# EAGLE schematic valve_indicator (EAGLE 9.6.2)

## Sheet 1 of 2: Processor
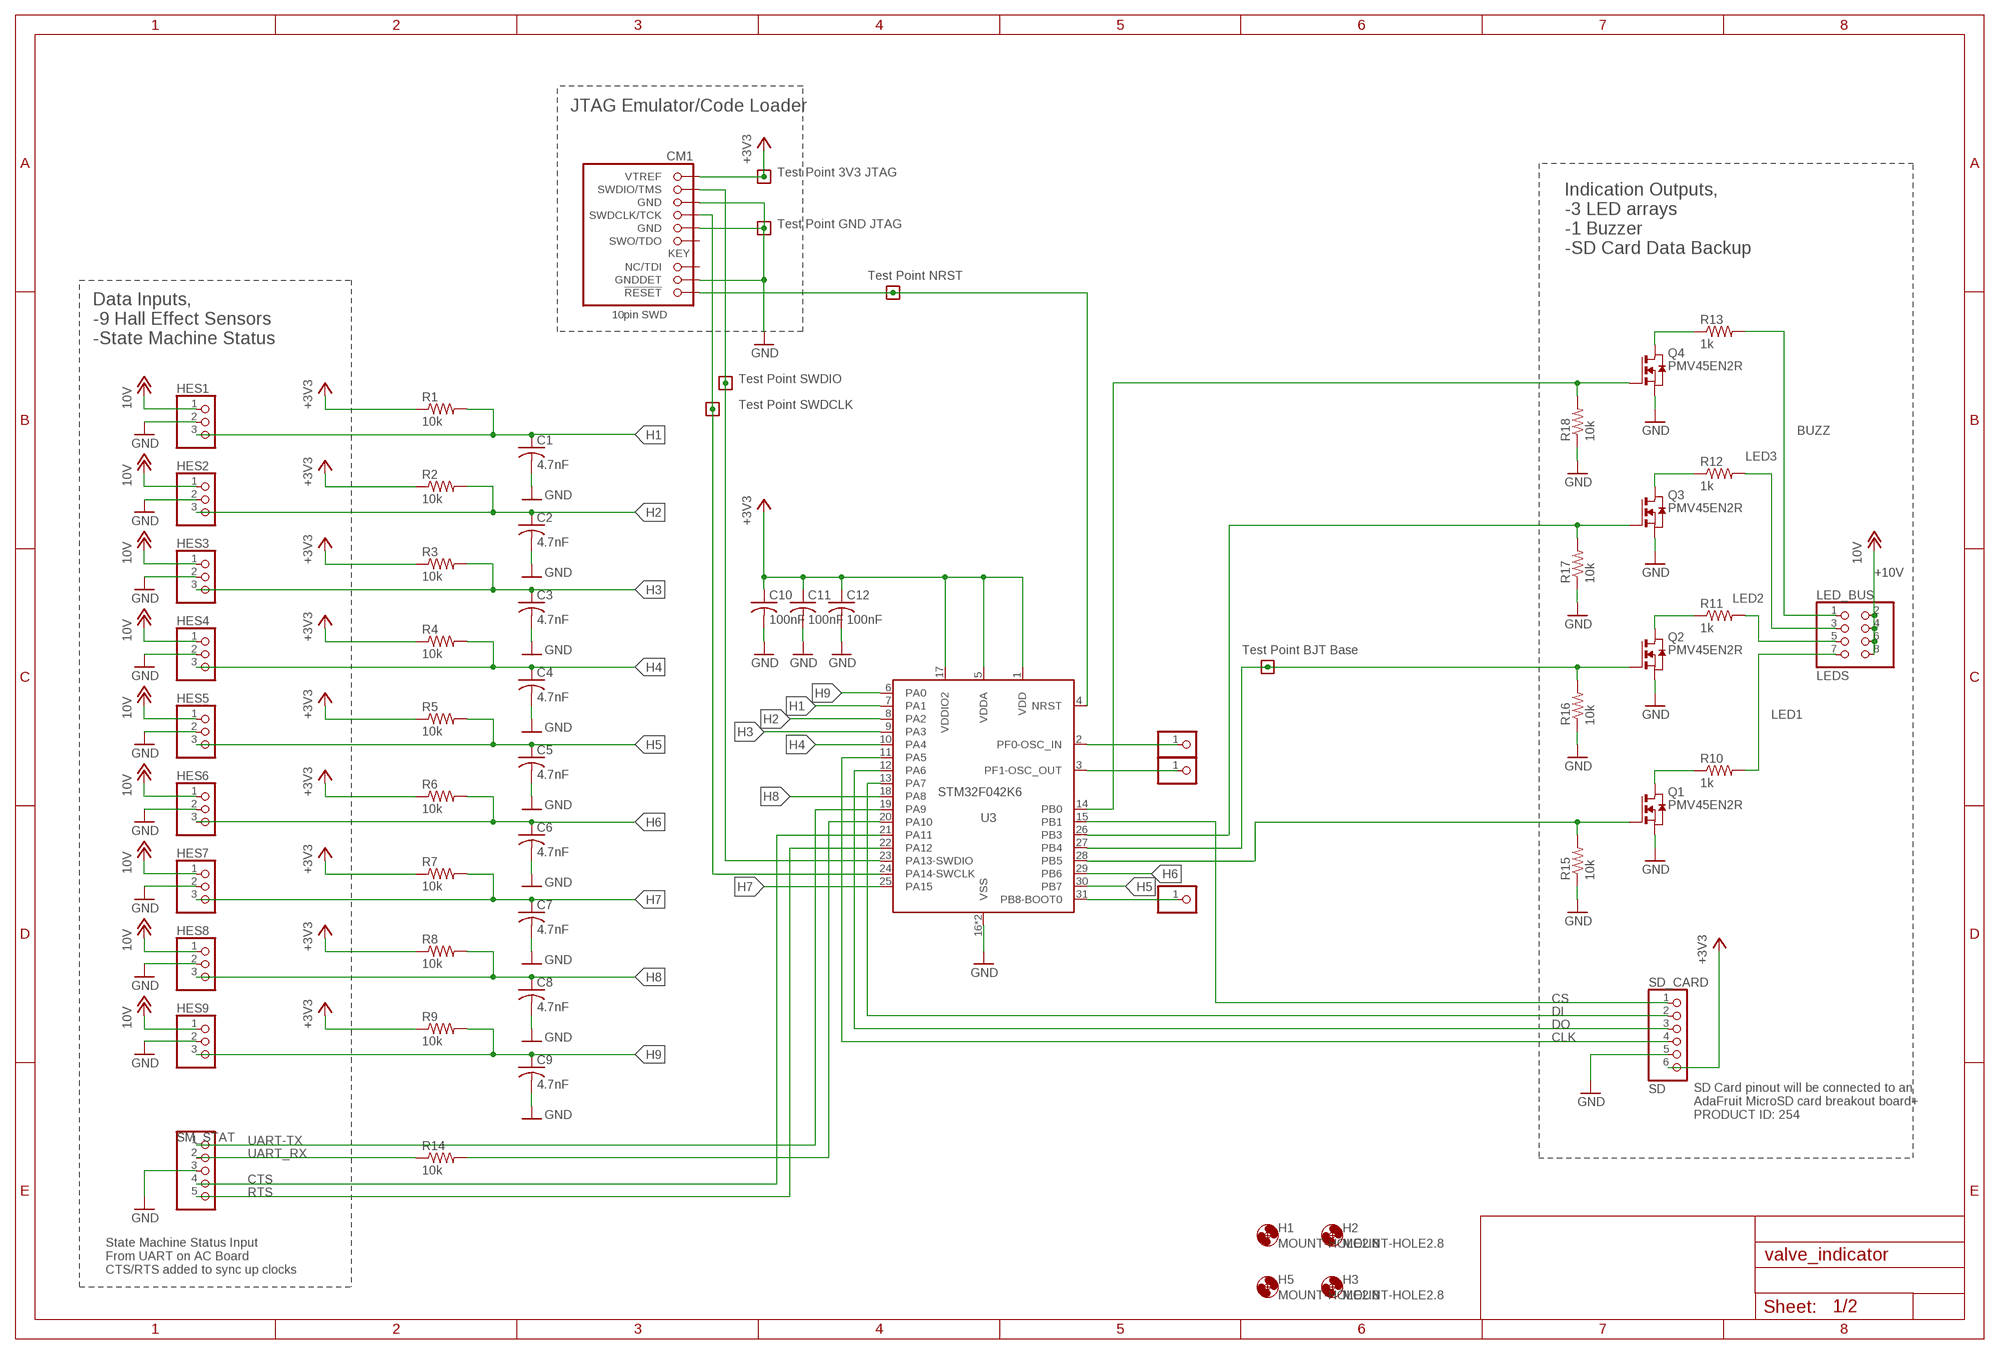
[diagram p0: schematic, sheet 1]

### Parts
C1  4.7nF  C-USC0603  [C0603]
C2  4.7nF  C-USC0603  [C0603]
C3  4.7nF  C-USC0603  [C0603]
C4  4.7nF  C-USC0603  [C0603]
C5  4.7nF  C-USC0603  [C0603]
C6  4.7nF  C-USC0603  [C0603]
C7  4.7nF  C-USC0603  [C0603]
C8  4.7nF  C-USC0603  [C0603]
C9  4.7nF  C-USC0603  [C0603]
C10  100nF  C-USC0603  [C0603]
C11  100nF  C-USC0603  [C0603]
C12  100nF  C-USC0603  [C0603]
CM1  FTSH-105-XX-X-DV-K  [CON10_2X5_DUK_FTSH]
H1  MOUNT-HOLE2.8  [2,8]
H2  MOUNT-HOLE2.8  [2,8]
H3  MOUNT-HOLE2.8  [2,8]
H5  MOUNT-HOLE2.8  [2,8]
HES1  HES1  PINHD-1X3  [1X03]
HES2  HES2  PINHD-1X3  [1X03]
HES3  HES3  PINHD-1X3  [1X03]
HES4  HES4  PINHD-1X3  [1X03]
HES5  HES5  PINHD-1X3  [1X03]
HES6  HES6  PINHD-1X3  [1X03]
HES7  HES7  PINHD-1X3  [1X03]
HES8  HES8  PINHD-1X3  [1X03]
HES9  HES9  PINHD-1X3  [1X03]
JP2  PF0-OSC_IN_PIN  PINHD-1X1  [1X01]
JP3  PF1-OSC_OUT_PIN  PINHD-1X1  [1X01]
JP4  PB8-BOOT0_PIN  PINHD-1X1  [1X01]
LED_BUS  LEDS  PINHD-2X4  [2X04]
Q1  PMV45EN2R  [SOT23]
Q2  PMV45EN2R  [SOT23]
Q3  PMV45EN2R  [SOT23]
Q4  PMV45EN2R  [SOT23]
R1  10k  R-US_R0603  [R0603]
R2  10k  R-US_R0603  [R0603]
R3  10k  R-US_R0603  [R0603]
R4  10k  R-US_R0603  [R0603]
R5  10k  R-US_R0603  [R0603]
R6  10k  R-US_R0603  [R0603]
R7  10k  R-US_R0603  [R0603]
R8  10k  R-US_R0603  [R0603]
R9  10k  R-US_R0603  [R0603]
R10  1k  R-US_R0603  [R0603]
R11  1k  R-US_R0603  [R0603]
R12  1k  R-US_R0603  [R0603]
R13  1k  R-US_R0603  [R0603]
R14  10k  R-US_R0603  [R0603]
R15  10k  R-US_R0603  [R0603]
R16  10k  R-US_R0603  [R0603]
R17  10k  R-US_R0603  [R0603]
R18  10k  R-US_R0603  [R0603]
SD_CARD  SD  PINHD-1X6  [1X06]
SM_STAT  SM_STAT  PINHD-1X5  [1X05]
TP3V3J  TEST-POINT-LARGE-SQUARE  [1X01]
TPBASE  TEST-POINT-LARGE-SQUARE  [1X01]
TPJGND  TEST-POINT-LARGE-SQUARE  [1X01]
TPNRST  TEST-POINT-LARGE-SQUARE  [1X01]
TPSCLK  TEST-POINT-LARGE-SQUARE  [1X01]
TPSIO  TEST-POINT-LARGE-SQUARE  [1X01]
U3  STM32F042K6  [QFP32-7X7]

### Nets
+3V3: C10.1 C11.1 C12.1 CM1.1(VTREF) R1.1 R2.1 R3.1 R4.1 R5.1 R6.1 R7.1 R8.1 R9.1 SD_CARD.6 TP3V3J.1 U3.1(VDD) U3.5(VDDA) U3.17(VDDIO2) ; also sheet 2
+10V: HES1.1 HES2.1 HES3.1 HES4.1 HES5.1 HES6.1 HES7.1 HES8.1 HES9.1 LED_BUS.2 LED_BUS.4 LED_BUS.6 LED_BUS.8 ; supply symbol labelled 10V ; also sheet 2
BUZZ: LED_BUS.1 R13.2
CLK: SD_CARD.4 U3.11(PA5)
CS: SD_CARD.1 U3.15(PB1)
CTS: SM_STAT.4 U3.21(PA11)
DI: SD_CARD.2 U3.13(PA7)
DO: SD_CARD.3 U3.12(PA6)
GND: C1.2 C2.2 C3.2 C4.2 C5.2 C6.2 C7.2 C8.2 C9.2 C10.2 C11.2 C12.2 CM1.3(GND) CM1.5(GND) CM1.9(GNDDET) HES1.2 HES2.2 HES3.2 HES4.2 HES5.2 HES6.2 HES7.2 HES8.2 HES9.2 Q1.2(S) Q2.2(S) Q3.2(S) Q4.2(S) R15.1 R16.1 R17.1 R18.1 SD_CARD.5 SM_STAT.3 TPJGND.1 U3.16(VSS) U3.32(VSS) ; also sheet 2
H1: C1.1 HES1.3 R1.2 U3.7(PA1)
H2: C2.1 HES2.3 R2.2 U3.8(PA2)
H3: C3.1 HES3.3 R3.2 U3.9(PA3)
H4: C4.1 HES4.3 R4.2 U3.10(PA4)
H5: C5.1 HES5.3 R5.2 U3.30(PB7)
H6: C6.1 HES6.3 R6.2 U3.29(PB6)
H7: C7.1 HES7.3 R7.2 U3.25(PA15)
H8: C8.1 HES8.3 R8.2 U3.18(PA8)
H9: C9.1 HES9.3 R9.2 U3.6(PA0)
LED1: LED_BUS.7 R10.2
LED2: LED_BUS.5 R11.2
LED3: LED_BUS.3 R12.2
N$1: Q4.3(D) R13.1
N$6: JP2.1 U3.2(PF0-OSC_IN)
N$7: JP3.1 U3.3(PF1-OSC_OUT)
N$8: JP4.1 U3.31(PB8-BOOT0)
N$9: CM1.4(SWDCLK/TCK) TPSCLK.1 U3.24(PA14-SWCLK)
N$13: Q3.3(D) R12.1
N$22: Q1.1(G) R15.2 U3.28(PB5)
N$24: Q3.1(G) R17.2 U3.26(PB3)
N$26: Q1.3(D) R10.1
N$27: Q2.3(D) R11.1
N$30: CM1.2(SWDIO/TMS) TPSIO.1 U3.23(PA13-SWDIO)
N$32: CM1.10(!RESET) TPNRST.1 U3.4(NRST)
N$34: Q4.1(G) R18.2 U3.14(PB0)
N$35: Q2.1(G) R16.2 TPBASE.1 U3.27(PB4)
RTS: SM_STAT.5 U3.22(PA12)
UART-RX: R14.2 U3.20(PA10)
UART-TX: SM_STAT.1 U3.19(PA9)
UART_RX: R14.1 SM_STAT.2
Unconnected: CM1.6(SWO/TDO) CM1.8(NC/TDI)

### Notes on the sheet
- JTAG Emulator/Code Loader
- Test Point 3V3 JTAG
- Test Point GND JTAG
- Indication Outputs,
  -3 LED arrays
  -1 Buzzer
  -SD Card Data Backup
- Test Point NRST
- Data Inputs, 
  -9 Hall Effect Sensors
  -State Machine Status
- Test Point SWDIO
- Test Point SWDCLK
- Test Point BJT Base
- SD Card pinout will be connected to an 
  AdaFruit MicroSD card breakout board+
  PRODUCT ID: 254
- State Machine Status Input
  From UART on AC Board
  CTS/RTS added to sync up clocks

## Sheet 2 of 2: Power Regulators
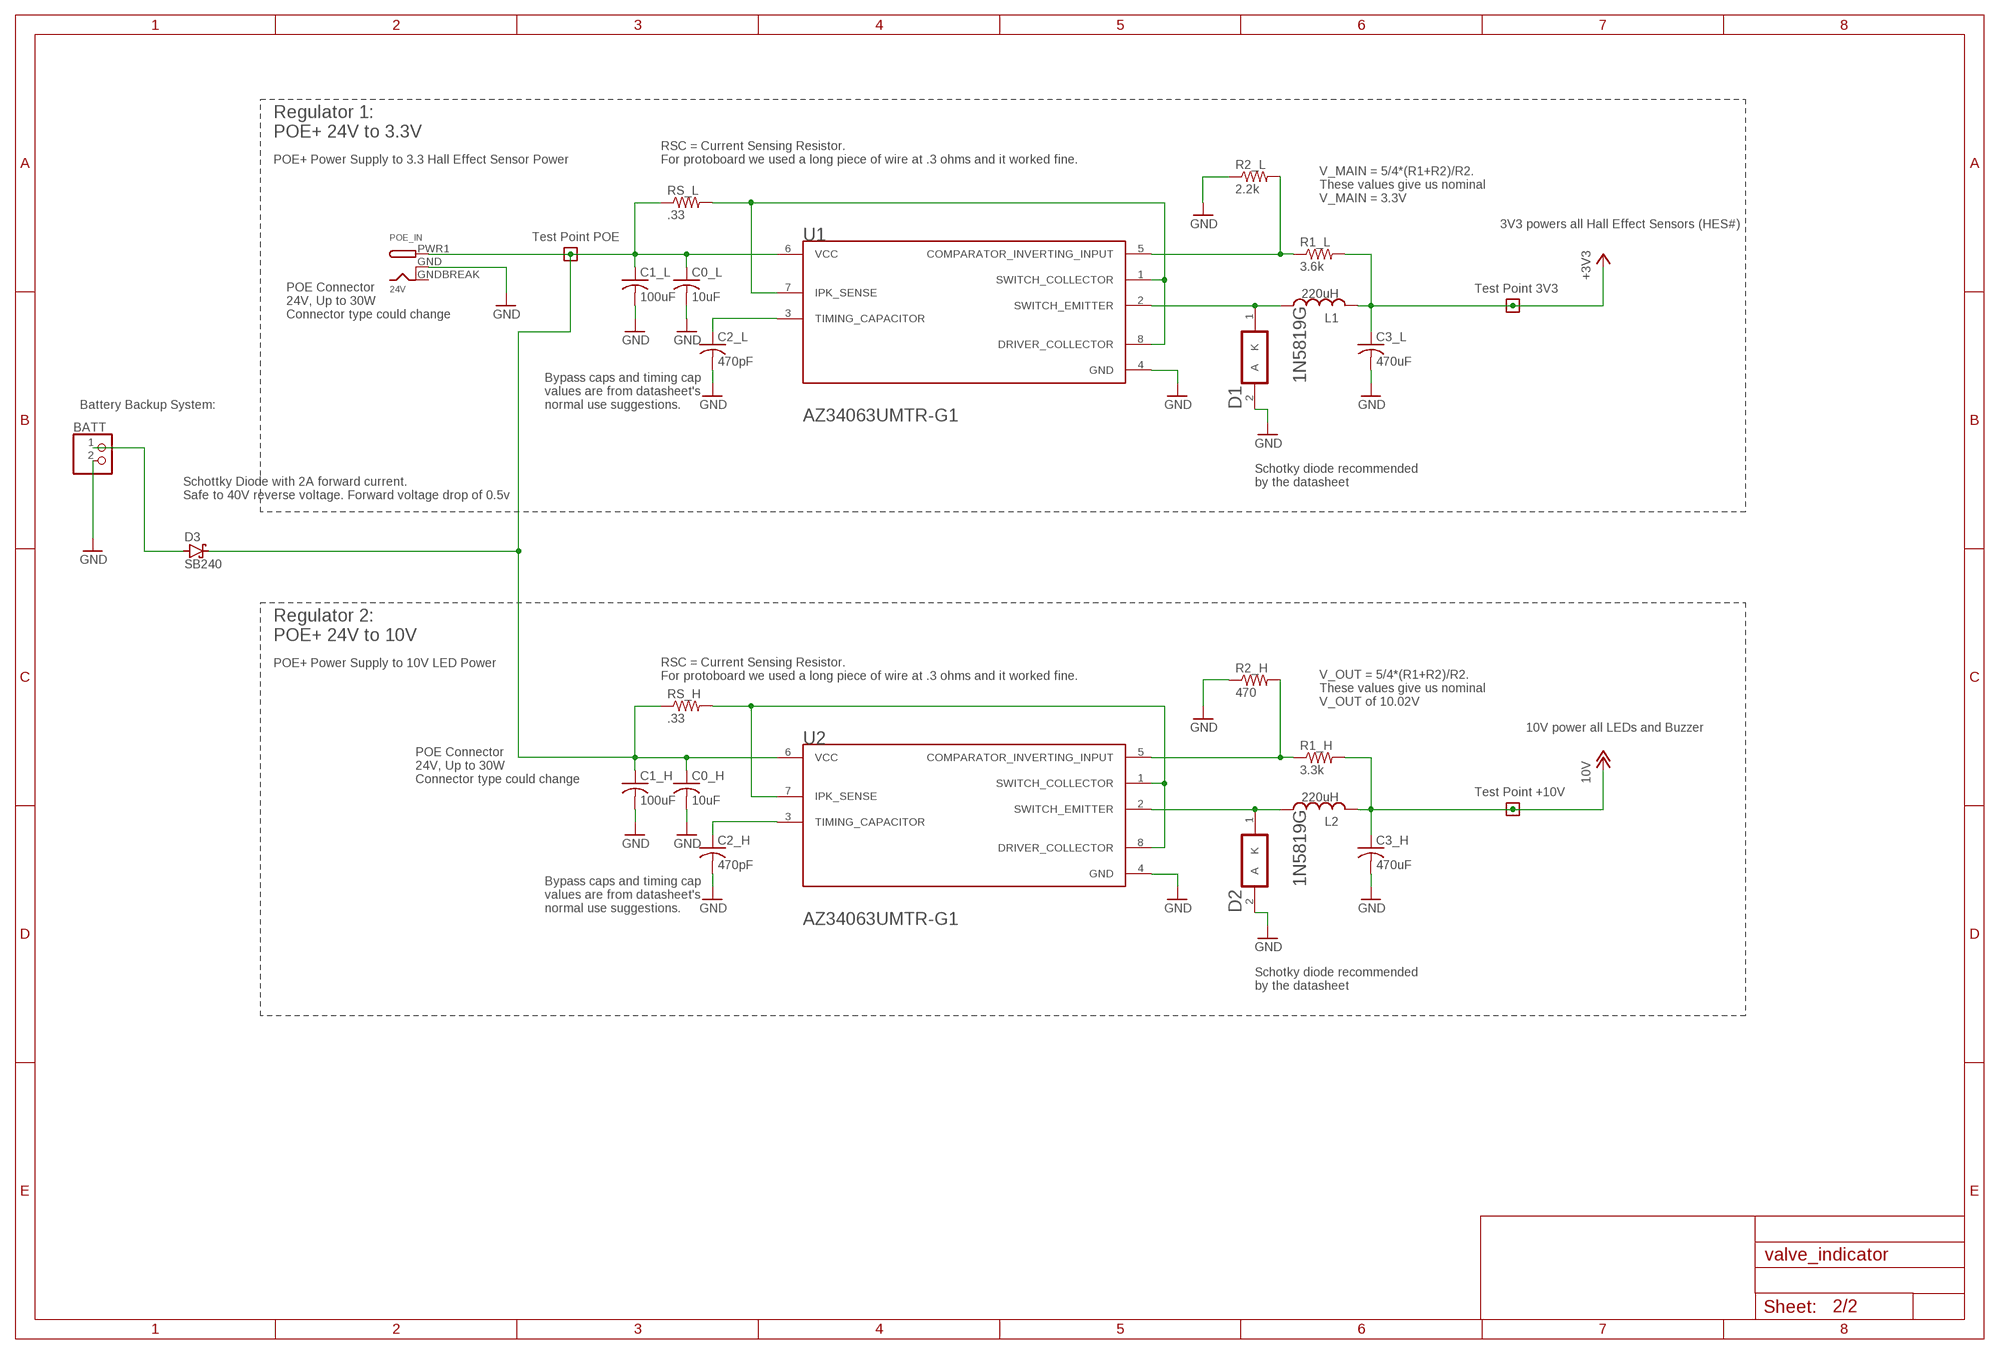
[diagram p1: schematic, sheet 2]

### Parts
BATT  LED1  PINHD-1X2  [1X02]
C0_H  10uF  C-USC1206  [C1206]
C0_L  10uF  C-USC1206  [C1206]
C1_H  100uF  C-US025-025X050  [C025-025X050]
C1_L  100uF  C-US025-025X050  [C025-025X050]
C2_H  470pF  C-USC0603  [C0603]
C2_L  470pF  C-USC0603  [C0603]
C3_H  470uF  C-US025-025X050  [C025-025X050]
C3_L  470uF  C-US025-025X050  [C025-025X050]
D1  1N5819G_0_0  ON_SEMICONDUCTOR_1N5819GON_SEMICONDUCTOR_1N5819G_0_0  [ON_SEMICONDUCTOR_1N5819G_0]
D2  1N5819G_0_0  ON_SEMICONDUCTOR_1N5819GON_SEMICONDUCTOR_1N5819G_0_0  [ON_SEMICONDUCTOR_1N5819G_0]
D3  SB240  1N5817-B  [DO41-7.6]
L1  220uH  L-US0204/5  [0204/5]
L2  220uH  L-US0204/5  [0204/5]
POE_IN  24V  DCBARRELSMT  [DCJACK_2MM_SMT]
R1_H  3.3k  R-US_R0603  [R0603]
R1_L  3.6k  R-US_R0603  [R0603]
R2_H  470  R-US_R0603  [R0603]
R2_L  2.2k  R-US_R0603  [R0603]
RS_H  .33  R-US_R0603  [R0603]
RS_L  .33  R-US_R0603  [R0603]
TP3V3  TEST-POINT-LARGE-SQUARE  [1X01]
TP10V  TEST-POINT-LARGE-SQUARE  [1X01]
TPOE  TEST-POINT-LARGE-SQUARE  [1X01]
U1  AZ34063UMTR-G1  DIODES_INC._AZ34063UMTR-G1DIODES_INC._AZ34063UMTR-G1_0_0  [DIODES_INC._AZ34063UMTR-G1_0]
U2  AZ34063UMTR-G1  DIODES_INC._AZ34063UMTR-G1DIODES_INC._AZ34063UMTR-G1_0_0  [DIODES_INC._AZ34063UMTR-G1_0]

### Nets
+3V3: C3_L.1 L1.2 R1_L.2 TP3V3.1 ; also sheet 1
+10V: C3_H.1 L2.2 R1_H.2 TP10V.1 ; supply symbol labelled 10V ; also sheet 1
GND: BATT.2 C0_H.2 C0_L.2 C1_H.2 C1_L.2 C2_H.2 C2_L.2 C3_H.2 C3_L.2 D1.2(A) D2.2(A) POE_IN.GND(GNDBREAK) R2_H.1 R2_L.1 U1.4(GND) U2.4(GND) ; also sheet 1
N$2: RS_L.2 U1.1(SWITCH_COLLECTOR) U1.7(IPK_SENSE) U1.8(DRIVER_COLLECTOR)
N$3: C2_L.1 U1.3(TIMING_CAPACITOR)
N$4: R1_L.1 R2_L.2 U1.5(COMPARATOR_INVERTING_INPUT)
N$5: D1.1(K) L1.1 U1.2(SWITCH_EMITTER)
N$10: D2.1(K) L2.1 U2.2(SWITCH_EMITTER)
N$16: BATT.1 D3.A
N$18: RS_H.2 U2.1(SWITCH_COLLECTOR) U2.7(IPK_SENSE) U2.8(DRIVER_COLLECTOR)
N$19: C2_H.1 U2.3(TIMING_CAPACITOR)
N$20: R1_H.1 R2_H.2 U2.5(COMPARATOR_INVERTING_INPUT)
POE: C0_H.1 C0_L.1 C1_H.1 C1_L.1 D3.C POE_IN.PWR1(PWR) RS_H.1 RS_L.1 TPOE.1 U1.6(VCC) U2.6(VCC)

### Notes on the sheet
- Regulator 1:
  POE+ 24V to 3.3V
- POE+ Power Supply to 3.3 Hall Effect Sensor Power
- RSC = Current Sensing Resistor.
  For protoboard we used a long piece of wire at .3 ohms and it worked fine.
- V_MAIN = 5/4*(R1+R2)/R2.
  These values give us nominal
  V_MAIN = 3.3V
- 3V3 powers all Hall Effect Sensors (HES#)
- Test Point POE
- Test Point 3V3
- POE Connector 
  24V, Up to 30W 
  Connector type could change
- Battery Backup System:
- Bypass caps and timing cap
  values are from datasheet's
  normal use suggestions.
- Schotky diode recommended
  by the datasheet
- Schottky Diode with 2A forward current. 
  Safe to 40V reverse voltage. Forward voltage drop of 0.5v
- Regulator 2:
  POE+ 24V to 10V
- POE+ Power Supply to 10V LED Power
- RSC = Current Sensing Resistor.
  For protoboard we used a long piece of wire at .3 ohms and it worked fine.
- V_OUT = 5/4*(R1+R2)/R2.
  These values give us nominal
  V_OUT of 10.02V
- 10V power all LEDs and Buzzer
- POE Connector 
  24V, Up to 30W 
  Connector type could change
- Test Point +10V
- Bypass caps and timing cap
  values are from datasheet's
  normal use suggestions.
- Schotky diode recommended
  by the datasheet

## Power pins joined to a net without a drawn wire
GND: POE_IN.GNDBREAK(GND)

## Library data of the parts
BATT = pinhead:PINHD-1X2: PIN HEADER; DIS: Digi-Key; DPN: 900-0022232021-ND; MFR: Molex; MPN: 0022232021
C0_H C0_L = rcl:C-US: CAPACITOR, American symbol; DIS: Digi-Key; DPN: 1276-6736-1-ND; MFR: Samsung Electro-Mechanics; MPN: CL31A106MBHNNNE; SPICEPREFIX: C
C1-C9 = rcl:C-US: CAPACITOR, American symbol; DIS: Digi-Key; DPN: 445-7400-1-ND; MFR: TDK Corporation; MPN: C1608C0G1H472J080AA; SPICEPREFIX: C
C1_H C1_L = rcl:C-US: CAPACITOR, American symbol; DIS: Digi-Key; DPN: 1572-1044-ND; MFR: Illinois Capacitor; MPN: 107CKR050M; SPICEPREFIX: C
C2_H C2_L = rcl:C-US: CAPACITOR, American symbol; DIS: Digi-Key; DPN: 1292-1438-1-ND; MFR: Walsin Technology Corporation; MPN: 0603B471K500CT; SPICEPREFIX: C
C3_H C3_L = rcl:C-US: CAPACITOR, American symbol; DIS: Digi-Key; DPN: 399-15683-ND; MFR: KEMET; MPN: ESH477M050AH4AA; SPICEPREFIX: C
C10-C12 = rcl:C-US: CAPACITOR, American symbol; DIS: Digi-Key; DPN: 1276-1006-1-ND; MFR: Samsung Electro-Mechanics; MPN: CL10B104KA8NNNC; SPICEPREFIX: C
CM1 = J-Samtec-FTSH-105-XXX-DV-K-ARM-SWD:FTSH-105-XX-X-DV-K; DIS: Digi-Key; DPN: SAM13160CT-ND; MFR: Samtec Inc.; MPN: FTSH-105-01-F-DV-K-TR
D1 D2 = On Semiconductor - 1N5819G:ON_SEMICONDUCTOR_1N5819G: ONSC-D-K1A2-2_A; DIS: Digi-Key; DPN: 1N5819GOS-ND; MFR: On Semiconductor; MPN: 1N5819G
D3 = diode:1N581*: 1.0A SCHOTTKY BARRIER RECTIFIER Source: http://www.diodes.com/datasheets/ds23001.pdf; DIS: Digi-Key; DPN: SB240-E3/54GICT-ND; MFR: Vishay Semiconductor Diodes Division; MPN: SB240-E3/54
H1-H3 H5 = holes:MOUNT-HOLE: MOUNTING HOLE with drill center marker
HES1-HES9 = pinhead:PINHD-1X3: PIN HEADER; DIS: Digi-Key; DPN: WM2701-ND; MFR: Molex; MPN: 0022112032
JP2-JP4 = pinhead:PINHD-1X1: PIN HEADER
L1 = rcl:L-US: INDUCTOR, American symbol; DIS: DigiKey; DPN: 811-2101-ND; MFR: Murata Power Solutions Inc.; MPN: 12RS224C; SPICEPREFIX: L
L2 = rcl:L-US: INDUCTOR, American symbol; DIS: Digi-Key; DPN: 811-2101-ND; MFR: Murata Power Solutions Inc.; MPN: 12RS224C; SPICEPREFIX: L
LED_BUS = pinhead:PINHD-2X4: PIN HEADER
POE_IN = adafruit:DCBARREL: 2.0mm DC Barrel Jack DCJACK_2MM_PTH - Through Hole Jack (4UConnector: 05537)
Q1-Q4 = Q-Nexperia-Nchannel-MOSFET-PMV45EN2R:PMV45EN2R: Nexperia PMV45EN2R N-channel MOSFET, 5.1 A, 30 V PMV45EN2, 3-Pin SOT-23 Source: Datasheet <http://uk.rs-online.com/web/p/products/1364806>; DESCRIPTION: Nexperia PMV45EN2R N-channel MOSFET, 5.1 A, 30 V PMV45EN2, 3-Pin SOT-23; DIS: Digi-Key; DPN: 1727-2307-1-ND; HEIGHT: 1.1mm; MANUFACTURER_NAME: Nexperia; MANUFACTURER_PART_NUMBER: PMV45EN2R; MFR: Nexperia USA Inc.; MOUSER_PART_NUMBER: 771-PMV45EN2R; MOUSER_PRICE-STOCK: https://www.mouser.com/Search/Refine.aspx?Keyword=771-PMV45EN2R; MPN: PMV45EN2R; RS_PART_NUMBER: 1364835P; RS_PRICE-STOCK: http://uk.rs-online.com/web/p/products/1364835P
R1-R9 R14-R18 = rcl:R-US_: RESISTOR, American symbol; DIS: Digi-Key; DPN: RMCF0603FT10K0CT-ND; MFR: Stackpole Electronics Inc; MPN: RMCF0603FT10K0; SPICEPREFIX: R
R1_H = rcl:R-US_: RESISTOR, American symbol; DIS: Digi-Key; DPN: 311-3.30KHRCT-ND; MFR: Yageo; MPN: RC0603FR-073K3L; SPICEPREFIX: R
R1_L = rcl:R-US_: RESISTOR, American symbol; DIS: Digi-Key; DPN: 311-3.60KHRCT-ND; MFR: Yageo; MPN: RC0603FR-073K6L; SPICEPREFIX: R
R2_H = rcl:R-US_: RESISTOR, American symbol; DIS: Digi-Key; DPN: A129684CT-ND; MFR: TE Connectivity Passive Product; MPN: CRGCQ0603F470R; SPICEPREFIX: R
R2_L = rcl:R-US_: RESISTOR, American symbol; DIS: Digi-Key; DPN: P2.20KHCT-ND; MFR: Panasonic Electronic Components; MPN: ERJ-3EKF2201V; SPICEPREFIX: R
R10-R13 = rcl:R-US_: RESISTOR, American symbol; DIS: Digi-Key; DPN: RMCF0603JJ1K00CT-ND; MFR: Stackpole Electronics Inc; MPN: RMCF0603JJ1K00; SPICEPREFIX: R
RS_H RS_L = rcl:R-US_: RESISTOR, American symbol; DIS: Digi-Key; DPN: P.33AJCT-ND; MFR: Panasonic Electronic Components; MPN: ERJ-3RQFR33V; SPICEPREFIX: R
SD_CARD = pinhead:PINHD-1X6: PIN HEADER; DIS: Digi-Key; DPN: A33867-ND; MFR: TE Connectivity AMP Connectors; MPN: 5-103635-5
SM_STAT = pinhead:PINHD-1X5: PIN HEADER; DIS: Digi-Key; DPN: WM2701-ND; MFR: Molex; MPN: 0022112032
TP3V3 TP3V3J TP10V TPBASE TPJGND TPNRST TPOE TPSCLK TPSIO = oresat-misc:TEST-POINT-LARGE-SQUARE
U1 U2 = Diodes Inc. - AZ34063UMTR-G1:DIODES_INC._AZ34063UMTR-G1: Buck, Boost Switching Regulator IC Positive or Negative Adjustable 1.25V 1 Output 1.5A (Switch) 8-SOIC (0.154", 3.90mm Width); DIS: Digi-Key; DPN: AZ34063UMTR-G1DICT-ND; MFR: Diodes Incorporated; MPN: AZ34063UMTR-G1
U3 = U-ST-STM32F042K-uC:STM32F042K6; DIS: Digi-Key; DPN: 497-14647-ND; MFR: STMicroelectronics; MPN: STM32F042K6T6